# EAGLE board oresat-acs-card (EAGLE 9.6.2), part 1 of 2
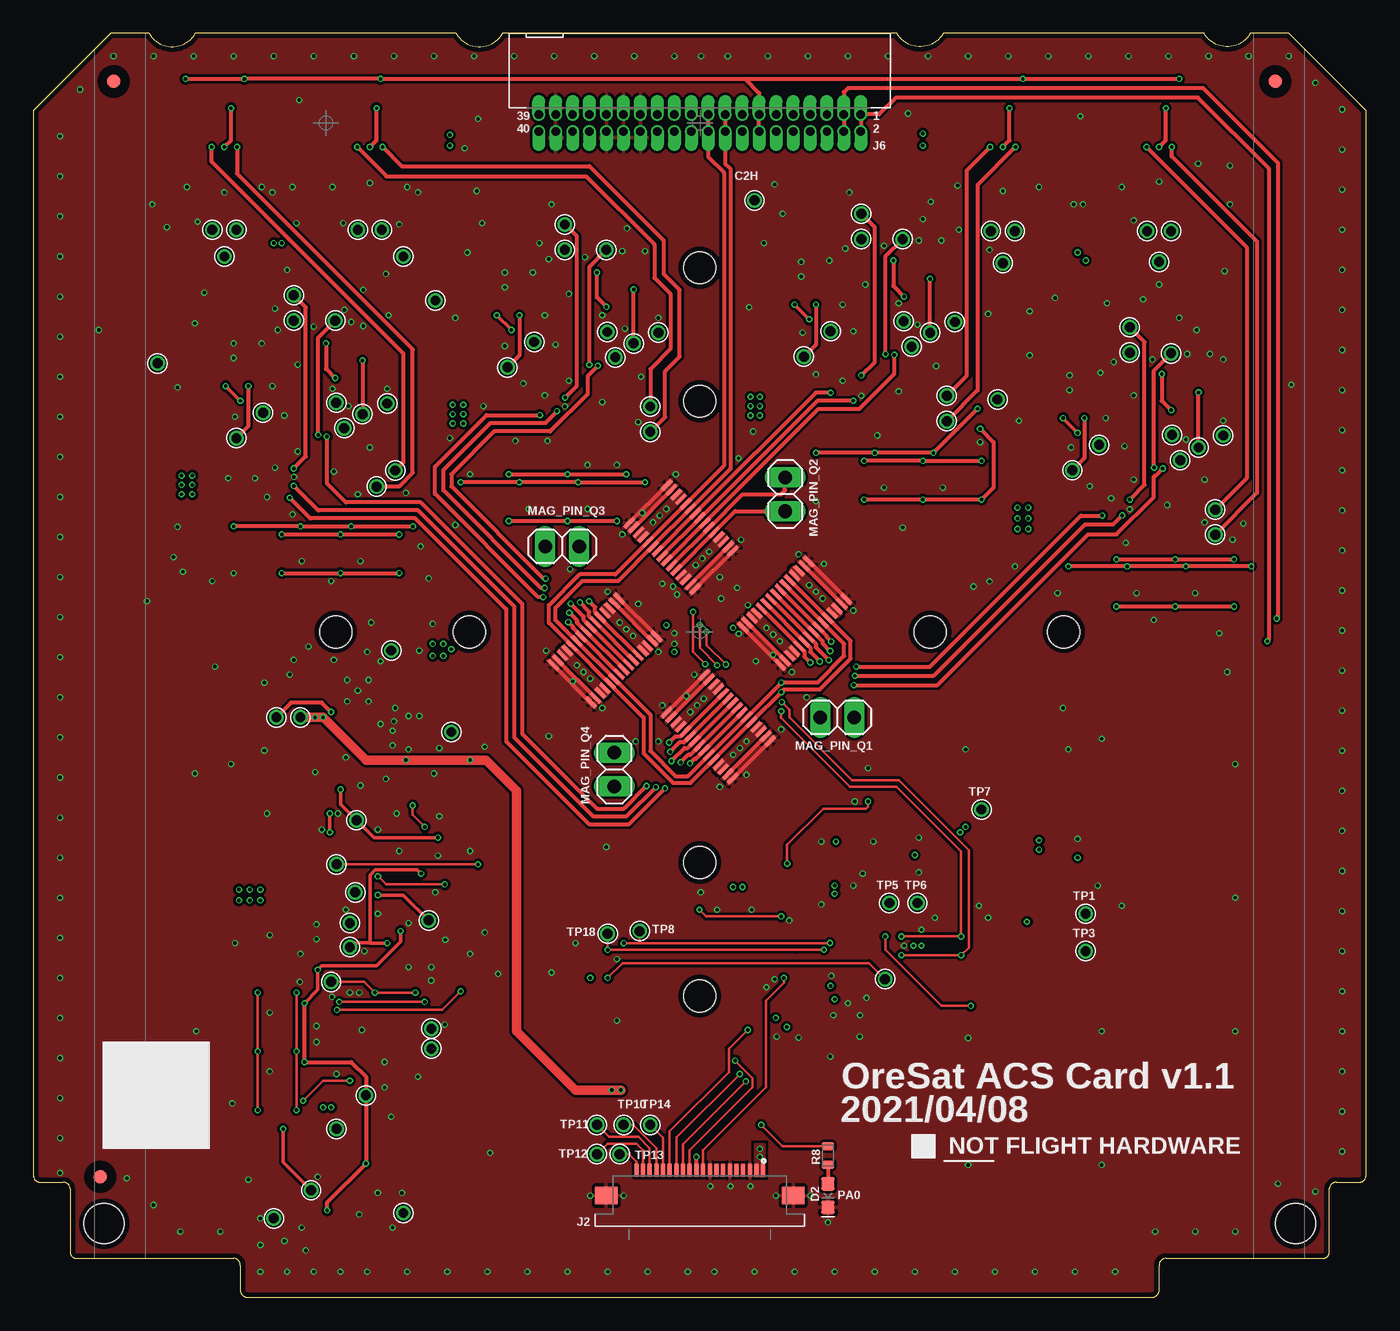
[diagram p8: board, top side]
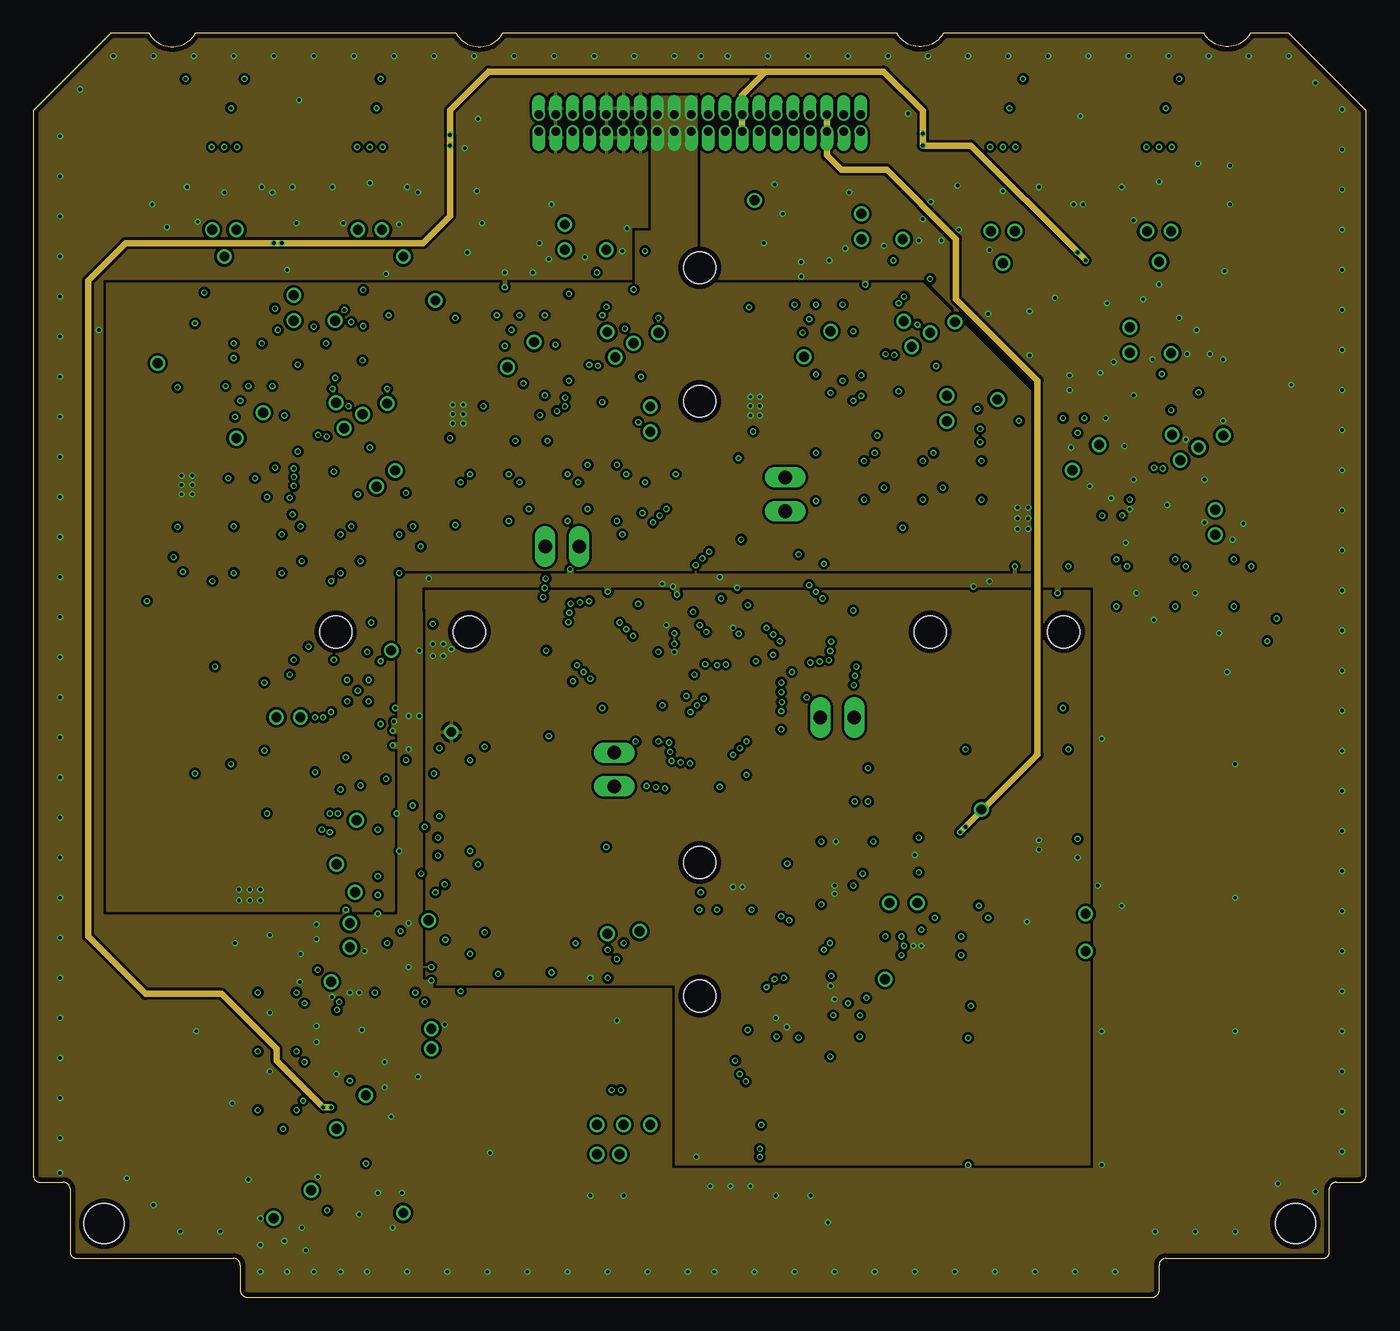
[diagram p9: board, inner layer Route2]
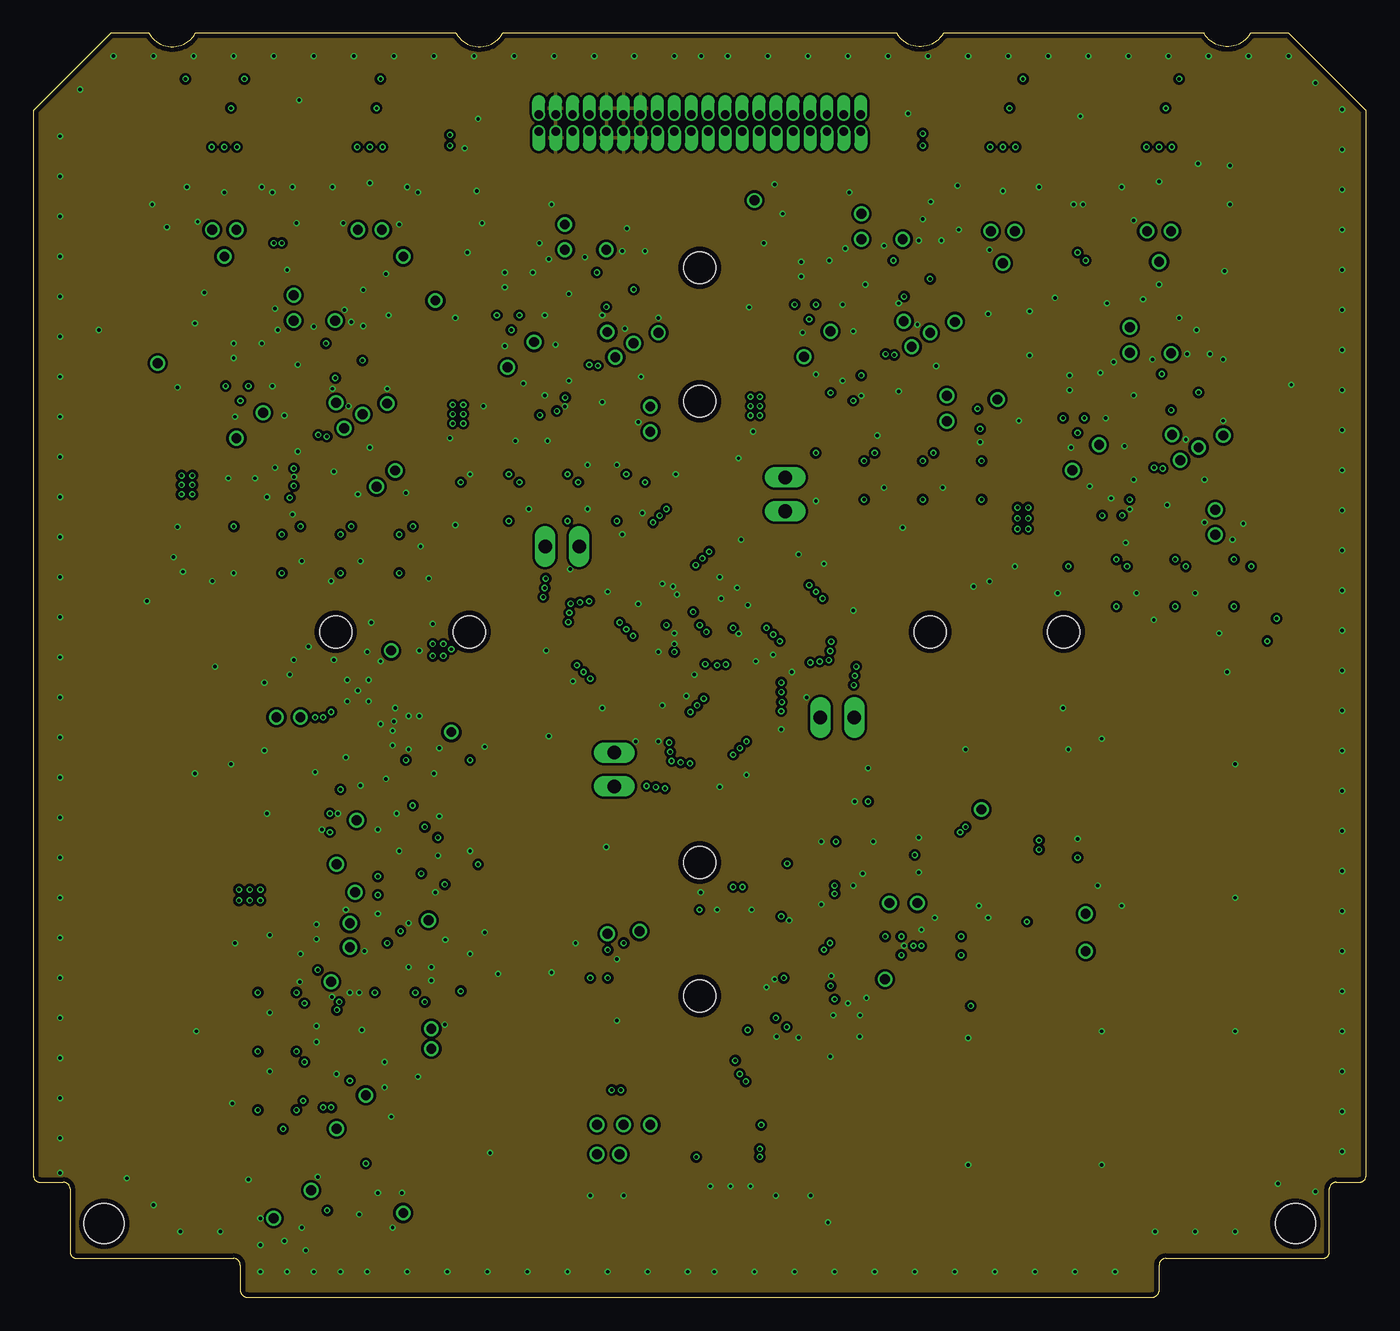
[diagram p10: board, inner layer Route15]
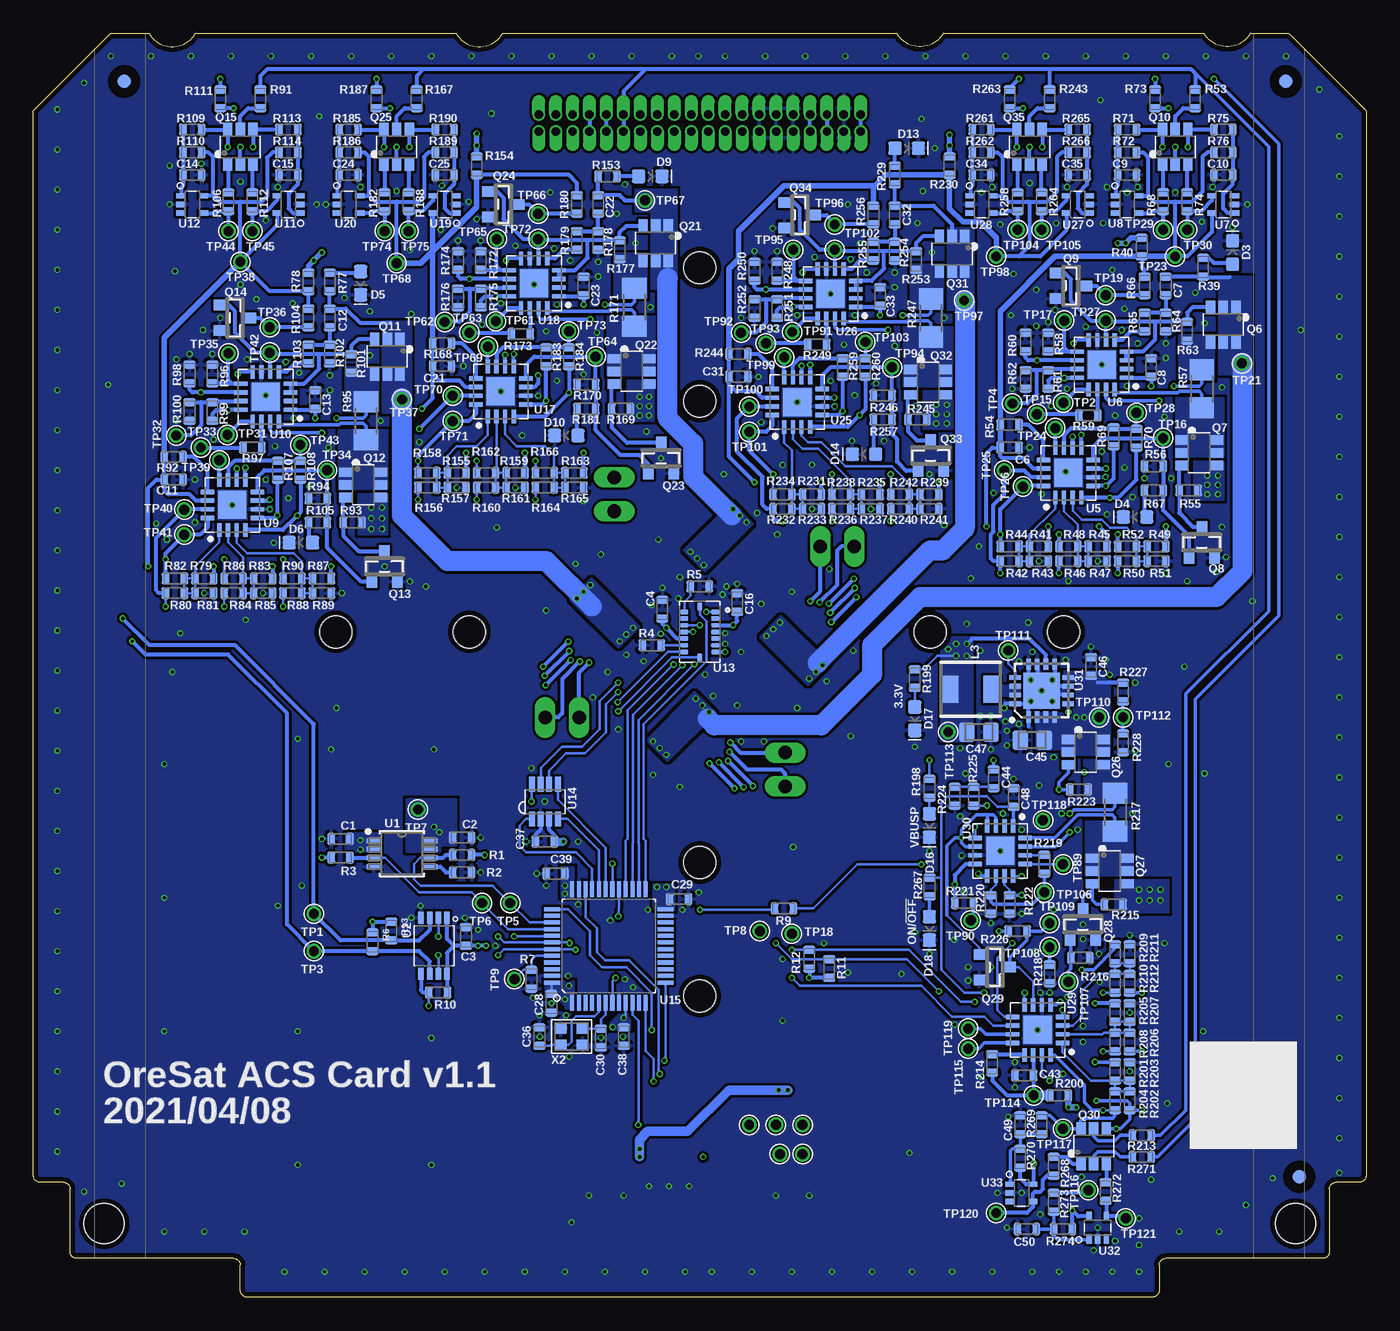
[diagram p11: board, bottom side, seen from below]

Size 99.8 x 94.6 mm. Coordinates in mm from the lower left corner, seen from the top.
Copper layers (1*2*15*16): Top 0.035559375mm / dielectric 0.17018125mm / Route2 0.01778125mm / dielectric 47mil / Route15 0.01778125mm / dielectric 0.17018125mm / Bottom 0.035559375mm
Design rules "oshpark-4layer-tented": minimum track width 5mil, minimum drill 10mil, track to track 5mil, track to pad 5mil, pad to pad 5mil, via to via 5mil, smd to smd 5mil, copper to edge 15mil, drill to drill 6mil, minimum pad ring 4mil, minimum via ring 4mil, stop-mask expansion 2.5mil, vias tented up to drill 20mil, thermal gap 10mil
Holes 2.4 mm at 32.64,49.8 22.64,49.8 67.16,49.8 77.16,49.8 49.9,67.06 49.9,77.06 49.9,32.54 49.9,22.54

## Footprints (pad centres in the part's own frame; a part is rotated, then mirrored left to right if it is on the bottom)
.0603-C-NOSILK = smd 0.6 x 0.9: 1 -0.7,0; 2 0.7,0
.0805-B-NOSILK = smd 1.15 x 1.45: 1 -0.9,0; 2 0.9,0
LED-0603 = smd 1 x 1: A -0.877,0; C 0.877,0
FIDUCIAL-1.0X2.0 = smd 1 x 1: FIDUCIAL 0,0
WURTH_687120183622 = smd 0.3 x 1: 1 -4.75,-1.9; 2 -4.25,-1.9; 3 -3.75,-1.9; 4 -3.25,-1.9; 5 -2.75,-1.9; 6 -2.25,-1.9; 7 -1.75,-1.9; 8 -1.25,-1.9; 9 -0.75,-1.9; 10 -0.25,-1.9; 11 0.25,-1.9; 12 0.75,-1.9; 13 1.25,-1.9; 14 1.75,-1.9; 15 2.25,-1.9; 16 2.75,-1.9; 17 3.25,-1.9; 18 3.75,-1.9; 19 4.25,-1.9; 20 4.75,-1.9 | smd 1.65 x 1.3: PAD1 7,0; PAD2 -7,0
J-SAMTEC-TFM-120-X1-XXX-D-RA = drill 0.635 pad 0.965 offset: 1 12.065,0.635; 2 12.065,-0.635; 3 10.795,0.635; 4 10.795,-0.635; 5 9.525,0.635; 6 9.525,-0.635; 7 8.255,0.635; 8 8.255,-0.635; 9 6.985,0.635; 10 6.985,-0.635; 11 5.715,0.635; 12 5.715,-0.635; 13 4.445,0.635; 14 4.445,-0.635; 15 3.175,0.635; 16 3.175,-0.635; 17 1.905,0.635; 18 1.905,-0.635; 19 0.635,0.635; 20 0.635,-0.635; 21 -0.635,0.635; 22 -0.635,-0.635; 23 -1.905,0.635; 24 -1.905,-0.635; 25 -3.175,0.635; 26 -3.175,-0.635; 27 -4.445,0.635; 28 -4.445,-0.635; 29 -5.715,0.635; 30 -5.715,-0.635; 31 -6.985,0.635; 32 -6.985,-0.635; 33 -8.255,0.635; 34 -8.255,-0.635; 35 -9.525,0.635; 36 -9.525,-0.635; 37 -10.795,0.635; 38 -10.795,-0.635; 39 -12.065,0.635; 40 -12.065,-0.635
ECS-MPI4040 = smd 2 x 1.3: 1 0,1.575; 2 0,-1.575
1X02 = drill 1.016 long: 1 -1.27,0; 2 1.27,0
ORESAT-CARD-V1.3-GENERIC-0RF = hole 3: 94.5,5.5; 5.3,5.5
SOT23-6 = smd 0.7 x 1: 1 -0.95,-1.3; 2 0,-1.3; 3 0.95,-1.3; 4 0.95,1.3; 5 0,1.3; 6 -0.95,1.3
SOT23 = smd 0.787 x 0.889: 1 -0.953,-1.143; 2 0.953,-1.143; 3 0,1.143
MEZZANINE_PLUG = smd 0.3 x 1: P$1 -3.5,2; P$2 -3,2; P$3 -2.5,2; P$4 -2,2; P$5 -1.5,2; P$6 -1,2; P$7 -0.5,2; P$8 0,2; P$9 0.5,2; P$10 1,2; P$11 1.5,2; P$12 2,2; P$13 2.5,2; P$14 3,2; P$15 3.5,2; P$16 3.5,-2; P$17 3,-2; P$18 2.5,-2; P$19 2,-2; P$20 1.5,-2; P$21 1,-2; P$22 0.5,-2; P$23 0,-2; P$24 -0.5,-2; P$25 -1,-2; P$26 -1.5,-2; P$27 -2,-2; P$28 -2.5,-2; P$29 -3,-2; P$30 -3.5,-2
R1206 = smd 1.6 x 1.803: 1 -1.422,0; 2 1.422,0
1X01 = drill 0.737 pad 1.1: 1 0,0
21-0036K-L = smd 1.06 x 0.376: 1 -2.134,0.975; 2 -2.134,0.325; 3 -2.134,-0.325; 4 -2.134,-0.975; 5 2.134,-0.975; 6 2.134,-0.325; 7 2.134,0.325; 8 2.134,0.975
MS8 = smd 0.42 x 0.889: 1 -0.975,-2.095; 2 -0.325,-2.095; 3 0.325,-2.095; 4 0.975,-2.095; 5 0.975,2.095; 6 0.325,2.095; 7 -0.325,2.095; 8 -0.975,2.095
QFN65P400X400X80-17T210 = smd 1.01 x 0.32: 1 -1.86,0.975; 2 -1.86,0.325; 3 -1.86,-0.325; 4 -1.86,-0.975; 9 1.86,-0.975; 10 1.86,-0.325; 11 1.86,0.325; 12 1.86,0.975 | smd 0.32 x 1.01: 5 -0.975,-1.86; 6 -0.325,-1.86; 7 0.325,-1.86; 8 0.975,-1.86; 13 0.975,1.86; 14 0.325,1.86; 15 -0.325,1.86; 16 -0.975,1.86 | smd 2.1 x 2.1: EPAD 0,0
SC70-5 = smd 0.4 x 0.7: 1 -0.65,-0.85; 2 0,-0.85; 3 0.65,-0.85; 4 0.65,0.85; 5 -0.65,0.85
PQFN50P450X300X100-16N = smd 0.35 x 0.58: 1 -1.5,1.16; 2 -1,1.16; 3 -0.5,1.16; 4 0,1.16; 5 0.5,1.16; 6 1,1.16; 7 1.5,1.16; 9 1.5,-1.16; 10 1,-1.16; 11 0.5,-1.16; 12 0,-1.16; 13 -0.5,-1.16; 14 -1,-1.16; 15 -1.5,-1.16 | smd 0.58 x 0.35: 8 1.91,0; 16 -1.91,0
SOT23-8_TI-DCN = smd 0.45 x 1.1: 1 -0.975,-1.3; 2 -0.325,-1.3; 3 0.325,-1.3; 4 0.975,-1.3; 5 0.975,1.3; 6 0.325,1.3; 7 -0.325,1.3; 8 -0.975,1.3
STM32F091C = smd 0.3 x 1.2: 1 -2.75,-4.25; 2 -2.25,-4.25; 3 -1.75,-4.25; 4 -1.25,-4.25; 5 -0.75,-4.25; 6 -0.25,-4.25; 7 0.25,-4.25; 8 0.75,-4.25; 9 1.25,-4.25; 10 1.75,-4.25; 11 2.25,-4.25; 12 2.75,-4.25; 25 2.75,4.25; 26 2.25,4.25; 27 1.75,4.25; 28 1.25,4.25; 29 0.75,4.25; 30 0.25,4.25; 31 -0.25,4.25; 32 -0.75,4.25; 33 -1.25,4.25; 34 -1.75,4.25; 35 -2.25,4.25; 36 -2.75,4.25 | smd 1.2 x 0.3: 13 4.25,-2.75; 14 4.25,-2.25; 15 4.25,-1.75; 16 4.25,-1.25; 17 4.25,-0.75; 18 4.25,-0.25; 19 4.25,0.25; 20 4.25,0.75; 21 4.25,1.25; 22 4.25,1.75; 23 4.25,2.25; 24 4.25,2.75; 37 -4.25,2.75; 38 -4.25,2.25; 39 -4.25,1.75; 40 -4.25,1.25; 41 -4.25,0.75; 42 -4.25,0.25; 43 -4.25,-0.25; 44 -4.25,-0.75; 45 -4.25,-1.25; 46 -4.25,-1.75; 47 -4.25,-2.25; 48 -4.25,-2.75
S-PVQFN-16 = smd 0.85 x 0.35: 1 -1.975,0.975; 2 -1.975,0.325; 3 -1.975,-0.325; 4 -1.975,-0.975; 9 1.975,-0.975; 10 1.975,-0.325; 11 1.975,0.325; 12 1.975,0.975 | smd 0.35 x 0.85: 5 -0.975,-1.975; 6 -0.325,-1.975; 7 0.325,-1.975; 8 0.975,-1.975; 13 0.975,1.975; 14 0.325,1.975; 15 -0.325,1.975; 16 -0.975,1.975 | smd 2.7 x 2.7: PAD 0,0
CRYSTAL_2.5X2 = smd 0.9 x 0.8: 1 -0.825,-0.625; 2 0.825,-0.625; 3 0.825,0.625; 4 -0.825,0.625

## Placement (x,y rotation side)
C1  1u  [.0603-C-NOSILK]  76.8,34.3 180 bottom
C2  1u  [.0603-C-NOSILK]  67.7,34.4 0 bottom
C3  1u  [.0603-C-NOSILK]  67.4,27 90 bottom
C4  1u  [.0603-C-NOSILK]  52.7,51.5 90 bottom
C6  100n  [.0603-C-NOSILK]  26.7,63.6 180 bottom
C7  1u  [.0603-C-NOSILK]  15,75.7 90 bottom
C8  1u  [.0603-C-NOSILK]  16.1,69.6 90 bottom
C9  1u  [.0603-C-NOSILK]  17.9,84 0 bottom
C10  1u  [.0603-C-NOSILK]  10.7,84 180 bottom
C11  100n  [.0603-C-NOSILK]  89.3,61.2 180 bottom
C12  1u  [.0603-C-NOSILK]  77.6,73.3 90 bottom
C13  1u  [.0603-C-NOSILK]  78.7,67.2 90 bottom
C14  1u  [.0603-C-NOSILK]  87.9,84 0 bottom
C15  1u  [.0603-C-NOSILK]  80.7,84 180 bottom
C16  1u  [.0603-C-NOSILK]  47.1,52 90 bottom
C21  100n  [.0603-C-NOSILK]  69.2,69.7 180 bottom
C22  1u  [.0603-C-NOSILK]  57.5,81.8 90 bottom
C23  1u  [.0603-C-NOSILK]  58.6,75.7 90 bottom
C24  1u  [.0603-C-NOSILK]  76.2,84 0 bottom
C25  1u  [.0603-C-NOSILK]  69,84 180 bottom
C28  100n  [.0603-C-NOSILK]  61,22 90 bottom
C29  100n  [.0603-C-NOSILK]  51.45,29.8 180 bottom
C30  20p  [.0603-C-NOSILK]  57.3,19.4 270 bottom
C31  100n  [.0603-C-NOSILK]  47,68.9 180 bottom
C32  1u  [.0603-C-NOSILK]  35.3,81 90 bottom
C33  1u  [.0603-C-NOSILK]  36.4,74.9 90 bottom
C34  1u  [.0603-C-NOSILK]  28.8,84 0 bottom
C35  1u  [.0603-C-NOSILK]  21.6,84 180 bottom
C36  20p  [.0603-C-NOSILK]  61.9,19.5 90 bottom
C37  100n  [.0603-C-NOSILK]  61.5,34.1 0 bottom
C38  100n  [.0603-C-NOSILK]  55.6,19.5 90 bottom
C39  100n  [.0603-C-NOSILK]  60.7,31.7 0 bottom
C43  100n  [.0603-C-NOSILK]  25.6,16.6 0 bottom
C44  1u  [.0603-C-NOSILK]  27.9,38.8 90 bottom
C45  10u  [.0805-B-NOSILK]  25,41.7 180 bottom
C46  1u  [.0603-C-NOSILK]  20.6,47.2 90 bottom
C47  22u  [.0805-B-NOSILK]  29,42.3 0 bottom
C48  1u  [.0603-C-NOSILK]  26.4,37.4 90 bottom
C49  1u  [.0603-C-NOSILK]  25.9,12.9 90 bottom
C50  1u  [.0603-C-NOSILK]  25.4,5.1 180 bottom
D2  AMBER  [LED-0603]  59.5,7.6 270 top
D3  GREEN  [LED-0603]  10,78.2 90 bottom
D4  AMBER  [LED-0603]  17.3,58.4 180 bottom
D5  GREEN  [LED-0603]  75.3,75.9 270 bottom
D6  AMBER  [LED-0603]  79.78,56.48 180 bottom
D9  GREEN  [LED-0603]  53.6,83.9 0 bottom
D10  AMBER  [LED-0603]  59.9,64.5 180 bottom
D13  GREEN  [LED-0603]  34.4,86 0 bottom
D14  AMBER  [LED-0603]  37.6,63.1 180 bottom
D16  GREEN  [LED-0603]  32.7,35.3 270 bottom
D17  GREEN  [LED-0603]  33.8,43.3 270 bottom
D18  AMBER  [LED-0603]  32.7,27.6 270 bottom
FIDUCIAL1  FIDUCIAL-1.0X2.0  [FIDUCIAL-1.0X2.0]  6,91 0 top
FIDUCIAL2  FIDUCIAL-1.0X2.0  [FIDUCIAL-1.0X2.0]  5,9 0 top
FIDUCIAL3  FIDUCIAL-1.0X2.0  [FIDUCIAL-1.0X2.0]  93,91 0 top
FIDUCIAL4  FIDUCIAL-1.0X2.0  [FIDUCIAL-1.0X2.0]  5,9 0 bottom
FIDUCIAL5  FIDUCIAL-1.0X2.0  [FIDUCIAL-1.0X2.0]  93,91 0 bottom
FIDUCIAL6  FIDUCIAL-1.0X2.0  [FIDUCIAL-1.0X2.0]  6,91 0 bottom
J2  ORESAT-DEBUG-CONNECTOR-SOLAR  [WURTH_687120183622]  49.9,7.6 180 top
J6  J-SAMTEC-TFM-120-X1-XXX-D-RA  [J-SAMTEC-TFM-120-X1-XXX-D-RA]  49.9,87.89 0 top
L3  6.8u  [ECS-MPI4040]  29.6,45.5 270 bottom
MAG_PIN_Q1  [1X02]  60.2,43.4 180 top
MAG_PIN_Q2  [1X02]  56.3,60.1 270 top
MAG_PIN_Q3  [1X02]  39.6,56.2 0 top
MAG_PIN_Q4  [1X02]  43.5,39.5 90 top
PCB1  ORESAT-CARD-V1.3-GENERIC-0RF  [ORESAT-CARD-V1.3-GENERIC-0RF]  0,0 0 top
Q6  MOSFET-PCH-SOT23-6  [SOT23-6]  10.7,72.8 180 bottom
Q7  MOSFET-PCH-SOT23-6  [SOT23-6]  12.5,63.2 270 bottom
Q8  PMV45EN  [SOT23]  12.3,56.5 0 bottom
Q9  PMV45EN  [SOT23]  22.1,75.7 270 bottom
Q10  DMP2240UDM  [SOT23-6]  14.3,86.1 0 bottom
Q11  MOSFET-PCH-SOT23-6  [SOT23-6]  73.3,70.4 180 bottom
Q12  MOSFET-PCH-SOT23-6  [SOT23-6]  75.1,60.8 270 bottom
Q13  PMV45EN  [SOT23]  73.5,54.7 0 bottom
Q14  PMV45EN  [SOT23]  84.7,73.3 270 bottom
Q15  DMP2240UDM  [SOT23-6]  84.3,86.1 0 bottom
Q21  MOSFET-PCH-SOT23-6  [SOT23-6]  53.2,78.9 180 bottom
Q22  MOSFET-PCH-SOT23-6  [SOT23-6]  55,69.3 270 bottom
Q23  PMV45EN  [SOT23]  52.8,62.8 0 bottom
Q24  PMV45EN  [SOT23]  64.6,81.8 270 bottom
Q25  DMP2240UDM  [SOT23-6]  72.6,86.1 0 bottom
Q26  MOSFET-PCH-SOT23-6  [SOT23-6]  21,40.8 270 bottom
Q27  MOSFET-PCH-SOT23-6  [SOT23-6]  19.2,31.9 270 bottom
Q28  PMV45EN  [SOT23]  21.2,27.9 0 bottom
Q29  PMV45EN  [SOT23]  27.8,24.7 270 bottom
Q30  DMP2240UDM  [SOT23-6]  20.4,11.3 0 bottom
Q31  MOSFET-PCH-SOT23-6  [SOT23-6]  31,78.1 180 bottom
Q32  MOSFET-PCH-SOT23-6  [SOT23-6]  32.8,68.5 270 bottom
Q33  PMV45EN  [SOT23]  32.6,63 0 bottom
Q34  PMV45EN  [SOT23]  42.4,81 270 bottom
Q35  DMP2240UDM  [SOT23-6]  25.2,86.1 0 bottom
QUADRANT1  MEZZANINE_PLUG  [MEZZANINE_PLUG]  57,51.2 225 top
QUADRANT2  MEZZANINE_PLUG  [MEZZANINE_PLUG]  48.5,56.9 315 top
QUADRANT3  MEZZANINE_PLUG  [MEZZANINE_PLUG]  42.8,48.4 45 top
QUADRANT4  MEZZANINE_PLUG  [MEZZANINE_PLUG]  51.3,42.7 135 top
R1  10k  [.0603-C-NOSILK]  67.7,33.1 0 bottom
R2  23.7k  [.0603-C-NOSILK]  67.7,31.8 180 bottom
R3  10k  [.0603-C-NOSILK]  76.8,32.9 180 bottom
R4  10k  [.0603-C-NOSILK]  53.5,48.8 0 bottom
R5  10k  [.0603-C-NOSILK]  49.9,53.2 180 bottom
R6  10k  [.0603-C-NOSILK]  74.4,26.6 270 bottom
R7  10k  [.0603-C-NOSILK]  62.5,23.8 90 bottom
R8  2.7k  [.0603-C-NOSILK]  59.5,10.6 90 top
R9  10k  [.0603-C-NOSILK]  43.6,29.1 180 bottom
R10  10k  [.0603-C-NOSILK]  69.5,22.8 180 bottom
R11  2.7k  [.0603-C-NOSILK]  40.2,24.6 270 bottom
R12  2.7k  [.0603-C-NOSILK]  41.7,25.3 270 bottom
R13  10k  [.0603-C-NOSILK]  73,27.4 270 bottom
R39  2.7k  [.0603-C-NOSILK]  12.2,77.1 270 bottom
R40  10  [.0603-C-NOSILK]  16.8,78.6 270 bottom
R41  NP  [.0603-C-NOSILK]  24.5,56.2 0 bottom
R42  NP  [.0603-C-NOSILK]  26.7,55.1 0 bottom
R43  NP  [.0603-C-NOSILK]  24.5,55.1 180 bottom
R44  NP  [.0603-C-NOSILK]  26.7,56.2 180 bottom
R45  NP  [.0603-C-NOSILK]  20.1,56.2 0 bottom
R46  NP  [.0603-C-NOSILK]  22.3,55.1 0 bottom
R47  NP  [.0603-C-NOSILK]  20.1,55.1 180 bottom
R48  NP  [.0603-C-NOSILK]  22.3,56.2 180 bottom
R49  NP  [.0603-C-NOSILK]  15.7,56.2 0 bottom
R50  NP  [.0603-C-NOSILK]  17.9,55.1 0 bottom
R51  NP  [.0603-C-NOSILK]  15.7,55.1 180 bottom
R52  NP  [.0603-C-NOSILK]  17.9,56.2 180 bottom
R53  100  [.0603-C-NOSILK]  12.8,89.7 270 bottom
R54  10k  [.0603-C-NOSILK]  26.7,65.3 180 bottom
R55  10k  [.0603-C-NOSILK]  13.3,60.4 0 bottom
R56  10k  [.0603-C-NOSILK]  15.9,62.2 0 bottom
R57  100m  [R1206]  12.3,68 90 bottom
R58  10k  [.0603-C-NOSILK]  23.8,71.5 270 bottom
R59  0  [.0603-C-NOSILK]  20.8,66 0 bottom
R60  NP  [.0603-C-NOSILK]  25.5,71.5 270 bottom
R61  0  [.0603-C-NOSILK]  23.8,68.7 270 bottom
R62  NP  [.0603-C-NOSILK]  25.5,68.7 90 bottom
R63  10k  [.0603-C-NOSILK]  13.4,72.3 270 bottom
R64  100k  [.0603-C-NOSILK]  15,73 90 bottom
R65  10k  [.0603-C-NOSILK]  16.6,73 90 bottom
R66  10k  [.0603-C-NOSILK]  16.6,75.7 90 bottom
R67  2.7k  [.0603-C-NOSILK]  15.9,60.4 0 bottom
R68  665k  [.0603-C-NOSILK]  15.2,82 90 bottom
R69  47k  [.0603-C-NOSILK]  18.9,64.4 270 bottom
R70  47k  [.0603-C-NOSILK]  17.2,64.3 270 bottom
R71  330k  [.0603-C-NOSILK]  17.9,87.4 0 bottom
R72  1M  [.0603-C-NOSILK]  17.9,85.7 0 bottom
R73  100  [.0603-C-NOSILK]  15.8,89.7 270 bottom
R74  665k  [.0603-C-NOSILK]  13.4,82 90 bottom
R75  330k  [.0603-C-NOSILK]  10.7,87.4 180 bottom
R76  1M  [.0603-C-NOSILK]  10.7,85.7 180 bottom
R77  2.7k  [.0603-C-NOSILK]  77.6,76 270 bottom
R78  10  [.0603-C-NOSILK]  79.2,76 270 bottom
R79  NP  [.0603-C-NOSILK]  87,53.8 0 bottom
R80  NP  [.0603-C-NOSILK]  89.2,52.7 0 bottom
R81  NP  [.0603-C-NOSILK]  87,52.7 180 bottom
R82  NP  [.0603-C-NOSILK]  89.2,53.8 180 bottom
R83  NP  [.0603-C-NOSILK]  82.6,53.8 0 bottom
R84  NP  [.0603-C-NOSILK]  84.8,52.7 0 bottom
R85  NP  [.0603-C-NOSILK]  82.6,52.7 180 bottom
R86  NP  [.0603-C-NOSILK]  84.8,53.8 180 bottom
R87  NP  [.0603-C-NOSILK]  78.2,53.8 0 bottom
R88  NP  [.0603-C-NOSILK]  80.4,52.7 0 bottom
R89  NP  [.0603-C-NOSILK]  78.2,52.7 180 bottom
R90  NP  [.0603-C-NOSILK]  80.4,53.8 180 bottom
R91  100  [.0603-C-NOSILK]  82.8,89.7 270 bottom
R92  10k  [.0603-C-NOSILK]  89.3,62.9 180 bottom
R93  10k  [.0603-C-NOSILK]  75.9,58 0 bottom
R94  10k  [.0603-C-NOSILK]  78.5,59.8 0 bottom
R95  100m  [R1206]  74.9,65.6 90 bottom
R96  10k  [.0603-C-NOSILK]  86.4,69.1 270 bottom
R97  0  [.0603-C-NOSILK]  83.4,63.6 0 bottom
R98  NP  [.0603-C-NOSILK]  88.1,69.1 270 bottom
R99  0  [.0603-C-NOSILK]  86.4,66.3 270 bottom
R100  NP  [.0603-C-NOSILK]  88.1,66.3 90 bottom
R101  10k  [.0603-C-NOSILK]  76,69.9 270 bottom
R102  100k  [.0603-C-NOSILK]  77.6,70.6 90 bottom
R103  10k  [.0603-C-NOSILK]  79.2,70.6 90 bottom
R104  10k  [.0603-C-NOSILK]  79.2,73.3 90 bottom
R105  2.7k  [.0603-C-NOSILK]  78.5,58 0 bottom
R106  665k  [.0603-C-NOSILK]  85.2,82 90 bottom
R107  47k  [.0603-C-NOSILK]  81.5,61.9 270 bottom
R108  47k  [.0603-C-NOSILK]  79.8,61.9 270 bottom
R109  330k  [.0603-C-NOSILK]  87.9,87.4 0 bottom
R110  1M  [.0603-C-NOSILK]  87.9,85.7 0 bottom
R111  100  [.0603-C-NOSILK]  85.8,89.7 270 bottom
R112  665k  [.0603-C-NOSILK]  83.4,82 90 bottom
R113  330k  [.0603-C-NOSILK]  80.7,87.4 180 bottom
R114  1M  [.0603-C-NOSILK]  80.7,85.7 180 bottom
R153  2.7k  [.0603-C-NOSILK]  56.8,83.9 180 bottom
R154  10  [.0603-C-NOSILK]  66.6,84.7 270 bottom
R155  NP  [.0603-C-NOSILK]  68.1,61.7 0 bottom
R156  NP  [.0603-C-NOSILK]  70.3,60.6 0 bottom
R157  NP  [.0603-C-NOSILK]  68.1,60.6 180 bottom
R158  NP  [.0603-C-NOSILK]  70.3,61.7 180 bottom
R159  NP  [.0603-C-NOSILK]  63.7,61.7 0 bottom
R160  NP  [.0603-C-NOSILK]  65.9,60.6 0 bottom
R161  NP  [.0603-C-NOSILK]  63.7,60.6 180 bottom
R162  NP  [.0603-C-NOSILK]  65.9,61.7 180 bottom
R163  NP  [.0603-C-NOSILK]  59.3,61.7 0 bottom
R164  NP  [.0603-C-NOSILK]  61.5,60.6 0 bottom
R165  NP  [.0603-C-NOSILK]  59.3,60.6 180 bottom
R166  NP  [.0603-C-NOSILK]  61.5,61.7 180 bottom
R167  100  [.0603-C-NOSILK]  71.1,89.7 270 bottom
R168  10k  [.0603-C-NOSILK]  69.2,71.4 180 bottom
R169  10k  [.0603-C-NOSILK]  55.8,66.5 0 bottom
R170  10k  [.0603-C-NOSILK]  58.4,68.3 0 bottom
R171  100m  [R1206]  54.8,74.1 90 bottom
R172  10k  [.0603-C-NOSILK]  66.3,77.6 270 bottom
R173  0  [.0603-C-NOSILK]  63.3,72.1 0 bottom
R174  NP  [.0603-C-NOSILK]  68,77.6 270 bottom
R175  0  [.0603-C-NOSILK]  66.3,74.8 270 bottom
R176  NP  [.0603-C-NOSILK]  68,74.8 90 bottom
R177  10k  [.0603-C-NOSILK]  55.9,78.4 270 bottom
R178  100k  [.0603-C-NOSILK]  57.5,79.1 90 bottom
R179  10k  [.0603-C-NOSILK]  59.1,79.1 90 bottom
R180  10k  [.0603-C-NOSILK]  59.1,81.8 90 bottom
R181  2.7k  [.0603-C-NOSILK]  58.4,66.5 0 bottom
R182  665k  [.0603-C-NOSILK]  73.5,82 90 bottom
R183  47k  [.0603-C-NOSILK]  61.4,70.4 270 bottom
R184  47k  [.0603-C-NOSILK]  59.7,70.4 270 bottom
R185  330k  [.0603-C-NOSILK]  76.2,87.4 0 bottom
R186  1M  [.0603-C-NOSILK]  76.2,85.7 0 bottom
R187  100  [.0603-C-NOSILK]  74.1,89.7 270 bottom
R188  665k  [.0603-C-NOSILK]  71.7,82 90 bottom
R189  330k  [.0603-C-NOSILK]  69,87.4 180 bottom
R190  1M  [.0603-C-NOSILK]  69,85.7 180 bottom
R198  2.7k  [.0603-C-NOSILK]  32.7,38.1 90 bottom
R199  2.7k  [.0603-C-NOSILK]  33.8,46.3 90 bottom
R200  10  [.0603-C-NOSILK]  23,15.1 180 bottom
R201  NP  [.0603-C-NOSILK]  18.8,16.9 90 bottom
R202  NP  [.0603-C-NOSILK]  17.7,14.7 90 bottom
R203  NP  [.0603-C-NOSILK]  17.7,16.9 270 bottom
R204  NP  [.0603-C-NOSILK]  18.8,14.7 270 bottom
R205  NP  [.0603-C-NOSILK]  18.8,21.3 90 bottom
R206  NP  [.0603-C-NOSILK]  17.7,19.1 90 bottom
R207  NP  [.0603-C-NOSILK]  17.7,21.3 270 bottom
R208  NP  [.0603-C-NOSILK]  18.8,19.1 270 bottom
R209  NP  [.0603-C-NOSILK]  18.8,25.7 90 bottom
R210  NP  [.0603-C-NOSILK]  17.7,23.5 90 bottom
R211  NP  [.0603-C-NOSILK]  17.7,25.7 270 bottom
R212  NP  [.0603-C-NOSILK]  18.8,23.5 270 bottom
R213  100  [.0603-C-NOSILK]  16.8,12.1 180 bottom
R214  10k  [.0603-C-NOSILK]  28,17.5 270 bottom
R215  10k  [.0603-C-NOSILK]  18.9,29.4 0 bottom
R216  10k  [.0603-C-NOSILK]  21.4,25.4 180 bottom
R217  100m  [R1206]  18.8,36.3 90 bottom
R218  10k  [.0603-C-NOSILK]  23.7,24.2 90 bottom
R219  0  [.0603-C-NOSILK]  24.1,32.4 90 bottom
R220  NP  [.0603-C-NOSILK]  28.1,29.4 90 bottom
R221  0  [.0603-C-NOSILK]  30.1,29.5 180 bottom
R222  NP  [.0603-C-NOSILK]  26.7,29.4 90 bottom
R223  10k  [.0603-C-NOSILK]  21.5,38 0 bottom
R224  100k  [.0603-C-NOSILK]  30.8,37.5 90 bottom
R225  10k  [.0603-C-NOSILK]  29.4,37.5 90 bottom
R226  10k  [.0603-C-NOSILK]  26.1,27.4 180 bottom
R227  10k  [.0603-C-NOSILK]  18.2,45.3 90 bottom
R228  NP  [.0603-C-NOSILK]  18.2,41.5 90 bottom
R229  2.7k  [.0603-C-NOSILK]  35.3,84 270 bottom
R230  10  [.0603-C-NOSILK]  31.2,84.7 270 bottom
R231  NP  [.0603-C-NOSILK]  41.5,60.1 0 bottom
R232  NP  [.0603-C-NOSILK]  43.7,59 0 bottom
R233  NP  [.0603-C-NOSILK]  41.5,59 180 bottom
R234  NP  [.0603-C-NOSILK]  43.7,60.1 180 bottom
R235  NP  [.0603-C-NOSILK]  37.1,60.1 0 bottom
R236  NP  [.0603-C-NOSILK]  39.3,59 0 bottom
R237  NP  [.0603-C-NOSILK]  37.1,59 180 bottom
R238  NP  [.0603-C-NOSILK]  39.3,60.1 180 bottom
R239  NP  [.0603-C-NOSILK]  32.7,60.1 0 bottom
R240  NP  [.0603-C-NOSILK]  34.9,59 0 bottom
R241  NP  [.0603-C-NOSILK]  32.7,59 180 bottom
R242  NP  [.0603-C-NOSILK]  34.9,60.1 180 bottom
R243  100  [.0603-C-NOSILK]  23.7,89.7 270 bottom
R244  10k  [.0603-C-NOSILK]  47,70.6 180 bottom
R245  10k  [.0603-C-NOSILK]  33.6,65.7 0 bottom
R246  10k  [.0603-C-NOSILK]  36.2,67.5 0 bottom
R247  100m  [R1206]  32.6,73.3 90 bottom
R248  10k  [.0603-C-NOSILK]  44.1,76.8 270 bottom
R249  0  [.0603-C-NOSILK]  41.1,71.3 0 bottom
R250  NP  [.0603-C-NOSILK]  45.8,76.8 270 bottom
R251  0  [.0603-C-NOSILK]  44.1,74 270 bottom
R252  NP  [.0603-C-NOSILK]  45.8,74 90 bottom
R253  10k  [.0603-C-NOSILK]  33.7,77.6 270 bottom
R254  100k  [.0603-C-NOSILK]  35.3,78.3 90 bottom
R255  10k  [.0603-C-NOSILK]  36.9,78.3 90 bottom
R256  10k  [.0603-C-NOSILK]  36.9,81 90 bottom
R257  2.7k  [.0603-C-NOSILK]  36.2,65.7 0 bottom
R258  665k  [.0603-C-NOSILK]  26.1,82 90 bottom
R259  47k  [.0603-C-NOSILK]  39.2,69.6 270 bottom
R260  47k  [.0603-C-NOSILK]  37.5,69.6 270 bottom
R261  330k  [.0603-C-NOSILK]  28.8,87.4 0 bottom
R262  1M  [.0603-C-NOSILK]  28.8,85.7 0 bottom
R263  100  [.0603-C-NOSILK]  26.7,89.7 270 bottom
R264  665k  [.0603-C-NOSILK]  24.3,82 90 bottom
R265  330k  [.0603-C-NOSILK]  21.6,87.4 180 bottom
R266  1M  [.0603-C-NOSILK]  21.6,85.7 180 bottom
R267  2.7k  [.0603-C-NOSILK]  32.7,30.7 90 bottom
R268  665k  [.0603-C-NOSILK]  23.4,9.8 90 bottom
R269  330k  [.0603-C-NOSILK]  24.3,12.9 90 bottom
R270  1M  [.0603-C-NOSILK]  25.9,10.4 270 bottom
R271  100  [.0603-C-NOSILK]  16.8,10.5 180 bottom
R272  665k  [.0603-C-NOSILK]  19.5,7.9 90 bottom
R273  330k  [.0603-C-NOSILK]  23.4,7.1 90 bottom
R274  1M  [.0603-C-NOSILK]  22.7,5.1 0 bottom
TP1  TEST-POINT-LARGE-SQUARE  [1X01]  78.8,28.7 0 top
TP2  TEST-POINT-LARGE-SQUARE  [1X01]  22.68,66.95 270 bottom
TP3  TEST-POINT-LARGE-SQUARE  [1X01]  78.8,25.9 0 top
TP4  TEST-POINT-LARGE-SQUARE  [1X01]  26.5,66.9 90 bottom
TP5  TEST-POINT-LARGE-SQUARE  [1X01]  64.1,29.5 0 top
TP6  TEST-POINT-LARGE-SQUARE  [1X01]  66.2,29.5 0 top
TP7  TEST-POINT-LARGE-SQUARE  [1X01]  71,36.5 0 top
TP8  TEST-POINT-LARGE-SQUARE  [1X01]  45.4,27.4 0 top
TP9  TEST-POINT-LARGE-SQUARE  [1X01]  63.78,23.8 270 bottom
TP10  TEST-POINT-LARGE-SQUARE  [1X01]  44.2,12.9 0 top
TP11  TEST-POINT-LARGE-SQUARE  [1X01]  42.2,12.9 0 top
TP12  TEST-POINT-LARGE-SQUARE  [1X01]  42.2,10.7 0 top
TP13  TEST-POINT-LARGE-SQUARE  [1X01]  43.9,10.7 0 top
TP14  TEST-POINT-LARGE-SQUARE  [1X01]  46.2,12.9 0 top
TP15  TEST-POINT-LARGE-SQUARE  [1X01]  24.65,66.09 90 bottom
TP16  TEST-POINT-LARGE-SQUARE  [1X01]  15.2,64.3 90 bottom
TP17  TEST-POINT-LARGE-SQUARE  [1X01]  22.6,73.1 270 bottom
TP18  TEST-POINT-LARGE-SQUARE  [1X01]  43,27.2 0 top
TP19  TEST-POINT-LARGE-SQUARE  [1X01]  19.5,75 90 bottom
TP21  TEST-POINT-LARGE-SQUARE  [1X01]  9.3,69.9 270 bottom
TP23  TEST-POINT-LARGE-SQUARE  [1X01]  14.3,77.9 180 bottom
TP24  TEST-POINT-LARGE-SQUARE  [1X01]  23.27,65.05 270 bottom
TP25  TEST-POINT-LARGE-SQUARE  [1X01]  27.1,61.88 90 bottom
TP26  TEST-POINT-LARGE-SQUARE  [1X01]  25.7,60.67 90 bottom
TP27  TEST-POINT-LARGE-SQUARE  [1X01]  19.5,73.1 90 bottom
TP28  TEST-POINT-LARGE-SQUARE  [1X01]  17.2,66.2 90 bottom
TP29  TEST-POINT-LARGE-SQUARE  [1X01]  15.2,79.9 90 bottom
TP30  TEST-POINT-LARGE-SQUARE  [1X01]  13.4,79.9 90 bottom
TP31  TEST-POINT-LARGE-SQUARE  [1X01]  85.28,64.55 270 bottom
TP32  TEST-POINT-LARGE-SQUARE  [1X01]  89.1,64.5 90 bottom
TP33  TEST-POINT-LARGE-SQUARE  [1X01]  87.25,63.6 90 bottom
TP34  TEST-POINT-LARGE-SQUARE  [1X01]  77.8,61.9 270 bottom
TP35  TEST-POINT-LARGE-SQUARE  [1X01]  85.2,70.64 90 bottom
TP36  TEST-POINT-LARGE-SQUARE  [1X01]  82.1,72.6 270 bottom
TP37  TEST-POINT-LARGE-SQUARE  [1X01]  72.2,67.2 270 bottom
TP38  TEST-POINT-LARGE-SQUARE  [1X01]  84.3,77.5 180 bottom
TP39  TEST-POINT-LARGE-SQUARE  [1X01]  85.88,62.65 90 bottom
TP40  TEST-POINT-LARGE-SQUARE  [1X01]  88.5,58.95 270 bottom
TP41  TEST-POINT-LARGE-SQUARE  [1X01]  88.5,57.08 270 bottom
TP42  TEST-POINT-LARGE-SQUARE  [1X01]  82.1,70.7 90 bottom
TP43  TEST-POINT-LARGE-SQUARE  [1X01]  79.8,63.8 270 bottom
TP44  TEST-POINT-LARGE-SQUARE  [1X01]  85.2,79.8 90 bottom
TP45  TEST-POINT-LARGE-SQUARE  [1X01]  83.4,79.8 90 bottom
TP61  TEST-POINT-LARGE-SQUARE  [1X01]  65.17,73.05 90 bottom
TP62  TEST-POINT-LARGE-SQUARE  [1X01]  69,73 90 bottom
TP63  TEST-POINT-LARGE-SQUARE  [1X01]  67.15,72.2 90 bottom
TP64  TEST-POINT-LARGE-SQUARE  [1X01]  57.7,70.4 90 bottom
TP65  TEST-POINT-LARGE-SQUARE  [1X01]  65.1,79.2 90 bottom
TP66  TEST-POINT-LARGE-SQUARE  [1X01]  62,81.1 90 bottom
TP67  TEST-POINT-LARGE-SQUARE  [1X01]  54,82.1 90 bottom
TP68  TEST-POINT-LARGE-SQUARE  [1X01]  72.6,77.4 0 bottom
TP69  TEST-POINT-LARGE-SQUARE  [1X01]  65.78,71.15 90 bottom
TP70  TEST-POINT-LARGE-SQUARE  [1X01]  68.4,67.47 90 bottom
TP71  TEST-POINT-LARGE-SQUARE  [1X01]  68.4,65.58 90 bottom
TP72  TEST-POINT-LARGE-SQUARE  [1X01]  62,79.2 90 bottom
TP73  TEST-POINT-LARGE-SQUARE  [1X01]  59.7,72.3 90 bottom
TP74  TEST-POINT-LARGE-SQUARE  [1X01]  73.5,79.8 90 bottom
TP75  TEST-POINT-LARGE-SQUARE  [1X01]  71.7,79.8 90 bottom
TP89  TEST-POINT-LARGE-SQUARE  [1X01]  22.7,32.4 270 bottom
TP90  TEST-POINT-LARGE-SQUARE  [1X01]  29.6,28.2 270 bottom
TP91  TEST-POINT-LARGE-SQUARE  [1X01]  42.98,72.25 90 bottom
TP92  TEST-POINT-LARGE-SQUARE  [1X01]  46.8,72.2 90 bottom
TP93  TEST-POINT-LARGE-SQUARE  [1X01]  44.95,71.4 90 bottom
TP94  TEST-POINT-LARGE-SQUARE  [1X01]  35.5,69.6 90 bottom
TP95  TEST-POINT-LARGE-SQUARE  [1X01]  42.9,78.4 90 bottom
TP96  TEST-POINT-LARGE-SQUARE  [1X01]  39.8,80.3 90 bottom
TP97  TEST-POINT-LARGE-SQUARE  [1X01]  30.1,74.6 270 bottom
TP98  TEST-POINT-LARGE-SQUARE  [1X01]  27.7,77.9 0 bottom
TP99  TEST-POINT-LARGE-SQUARE  [1X01]  43.58,70.35 270 bottom
TP100  TEST-POINT-LARGE-SQUARE  [1X01]  46.2,66.67 90 bottom
TP101  TEST-POINT-LARGE-SQUARE  [1X01]  46.2,64.78 90 bottom
TP102  TEST-POINT-LARGE-SQUARE  [1X01]  39.8,78.4 270 bottom
TP103  TEST-POINT-LARGE-SQUARE  [1X01]  37.5,71.5 90 bottom
TP104  TEST-POINT-LARGE-SQUARE  [1X01]  26.1,79.9 270 bottom
TP105  TEST-POINT-LARGE-SQUARE  [1X01]  24.3,79.9 270 bottom
TP106  TEST-POINT-LARGE-SQUARE  [1X01]  24.1,30.3 270 bottom
TP107  TEST-POINT-LARGE-SQUARE  [1X01]  22.3,23.6 0 bottom
TP108  TEST-POINT-LARGE-SQUARE  [1X01]  23.7,26.2 270 bottom
TP109  TEST-POINT-LARGE-SQUARE  [1X01]  23.7,28 270 bottom
TP110  TEST-POINT-LARGE-SQUARE  [1X01]  20,43.4 270 bottom
TP111  TEST-POINT-LARGE-SQUARE  [1X01]  26.8,48.4 90 bottom
TP112  TEST-POINT-LARGE-SQUARE  [1X01]  18.2,43.4 270 bottom
TP113  TEST-POINT-LARGE-SQUARE  [1X01]  31.3,42.3 90 bottom
TP114  TEST-POINT-LARGE-SQUARE  [1X01]  24.9,15.1 270 bottom
TP115  TEST-POINT-LARGE-SQUARE  [1X01]  29.8,18.6 270 bottom
TP116  TEST-POINT-LARGE-SQUARE  [1X01]  20.8,8 270 bottom
TP117  TEST-POINT-LARGE-SQUARE  [1X01]  22.7,12.6 270 bottom
TP118  TEST-POINT-LARGE-SQUARE  [1X01]  24.2,35.7 270 bottom
TP119  TEST-POINT-LARGE-SQUARE  [1X01]  29.8,20.1 270 bottom
TP120  TEST-POINT-LARGE-SQUARE  [1X01]  27.7,6.3 270 bottom
TP121  TEST-POINT-LARGE-SQUARE  [1X01]  18,5.9 270 bottom
U1  MAX892LEUA+T21-0036K-L  [21-0036K-L]  72.2,33.2 0 bottom
U2  LTC4300A-1  [MS8]  69.8,26.3 180 bottom
U5  MAX7310ATE  [QFN65P400X400X80-17T210]  22.3,61.7 90 bottom
U6  MAX4211FETE  [QFN65P400X400X80-17T210]  19.8,69.8 180 bottom
U7  MIC842LYC5  [SC70-5]  10.7,81.8 90 bottom
U8  MIC842LYC5  [SC70-5]  17.9,81.8 270 bottom
U9  MAX7310ATE  [QFN65P400X400X80-17T210]  84.9,59.3 90 bottom
U10  MAX4211FETE  [QFN65P400X400X80-17T210]  82.4,67.4 180 bottom
U11  MIC842LYC5  [SC70-5]  80.7,81.8 90 bottom
U12  MIC842LYC5  [SC70-5]  87.9,81.8 270 bottom
U13  BMI088  [PQFN50P450X300X100-16N]  49.9,49.8 270 bottom
U14  TCAN330  [SOT23-8_TI-DCN]  61.5,37.1 0 bottom
U15  STM32F091C  [STM32F091C]  56.7,26.3 0 bottom
U17  MAX7310ATE  [QFN65P400X400X80-17T210]  64.8,67.8 90 bottom
U18  MAX4211FETE  [QFN65P400X400X80-17T210]  62.3,75.9 180 bottom
U19  MIC842LYC5  [SC70-5]  69,81.8 90 bottom
U20  MIC842LYC5  [SC70-5]  76.2,81.8 270 bottom
U25  MAX7310ATE  [QFN65P400X400X80-17T210]  42.6,67 90 bottom
U26  MAX4211FETE  [QFN65P400X400X80-17T210]  40.1,75.1 180 bottom
U27  MIC842LYC5  [SC70-5]  21.6,81.8 90 bottom
U28  MIC842LYC5  [SC70-5]  28.8,81.8 270 bottom
U29  MAX7310ATE  [QFN65P400X400X80-17T210]  24.6,20 180 bottom
U30  MAX4211FETE  [QFN65P400X400X80-17T210]  27.4,33.4 270 bottom
U31  TPS62111RSA  [S-PVQFN-16]  24.3,45.4 90 bottom
U32  MIC842LYC5  [SC70-5]  20.1,5.2 0 bottom
U33  MIC842LYC5  [SC70-5]  25.8,7.8 270 bottom
U$1  FLIGHMARKERNEW  [FLIGHTMARKER_NEW_BOARDS]  66,10.7 0 top
X2  16MHZ-2.5x2mm  [CRYSTAL_2.5X2]  59.5,19.5 0 bottom